# Altium schematic sheet POWER.SchDoc
size A4; SheetNumber: 2; SheetTotal: 3
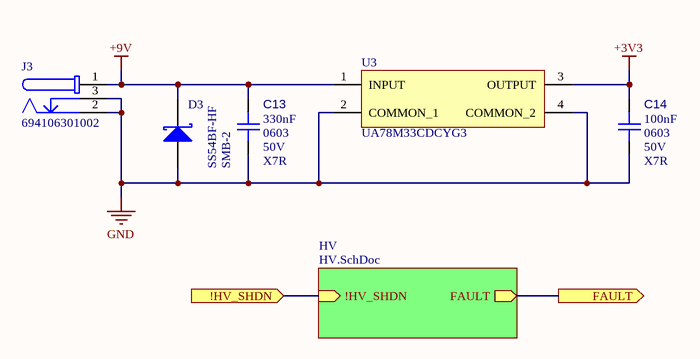
[diagram p0: POWER.SchDoc]

## Parts
?  (no value)
C13  value 330nF  Rated DC Voltage (URdc): 50V  Case/Package: 0603  Dielectric: X7R  [CAPC1608X10N]  (hidden comment: C1608X7R1H334K080AC)
C14  value 100nF  Voltage Rating: 50V  Case/Package: 0603  Dielectric: X7R  [CAPC1608X09N]  (hidden comment: CGA3E2X7R1H104K080AA)
D3  SS54BF-HF  Case/Package: SMB-2  [JCET-SMB-2_N]
J3  694106301002  [694106301002]
U3  UA78M33CDCYG3  [SOT-223-DB3_N]

## Sub-sheets
HV = HV.SchDoc: FAULT (out), !HV_SHDN (in)

## Ports
!HV_SHDN (in), FAULT (out)

## Nets
+3V3: C14.1 U3.3(OUTPUT)
+9V: C13.1 D3.2(K) J3.1 U3.1(INPUT)
GND: C13.2 C14.2 D3.1(A) J3.2 J3.3 U3.2(COMMON_1) U3.4(COMMON_2)
!HV_SHDN: port !HV_SHDN, sheet HV/!HV_SHDN
FAULT: port FAULT, sheet HV/FAULT

## Notes on the sheet
- Project:
- Designer:
- Sheet
- of
- Filename:

## Library data of the parts
? = CMP-00003-4: The KETS Schematic Sheet Title Block
C13 = CMP-001-00114-1: Ceramic Capacitor, Multilayer, Ceramic, 50V, 10% +Tol, 10% -Tol, X7R, 15% TC, 0.33uF, Surface Mount, 0603; Multilayer: Yes; JESD-609 Code: e3; Width: 0.8mm; Voltage Rating: 50V; Tolerance  (fill in as +-): 10%; Packaging: Tape and Reel; Dielectric Material: Ceramic; Capacitor Type: Ceramic; Pins: 2; Package Shape: Rectangular; Reach SVHC Compliant: Yes; Package Style: SMTMeter; Min Operating Temperature: -55°C; Length: 1.6mm; Max Operating Temperature: 125°C; Terminal Finish: Nickel; Tolerance (fill in as +-): 10%; Termination: Wraparound; RoHS Compliant: Yes; Mounting Technology: Surface Mount; Temperature Characteristics Code: X7R; Tolerance: 10%; Height: 0.8mm
C14 = CMP-001-00101-1: Ceramic Capacitor, Multilayer, Ceramic, 50V, 10% +Tol, 10% -Tol, X7R, 15% TC, 0.1uF, Surface Mount, 0603; Reference Standard: AEC-Q200; Multilayer: Yes; Tolerance  (fill in as +-): 10%; Mounting Technology: Surface Mount; Max Operating Temperature: 125°C; Min Operating Temperature: -55°C; Tolerance: 10%; Packaging: Tape and Reel; Length: 1.6mm; Package Style: SMTMeter; Width: 0.8mm; Height: 0.8mm; Pins: 2; Reach SVHC Compliant: Yes; RoHS Compliant: Yes; Package Shape: Rectangular; Tolerance (fill in as +-): 10%; Rated DC Voltage (URdc): 50V; JESD-609 Code: e3; Capacitor Type: Ceramic; Termination: Wraparound; Terminal Finish: Nickel; Dielectric Material: Ceramic; Temperature Characteristics Code: X7R
D3 = CMP-004-00006-3: Rectifier Diode, Schottky, 1 Phase, 1 Element, 5A, 40V V(RRM), Silicon; Manufacturer: JCET; Forward Voltage: 550mV; Peak Reverse Current: 1mA; Max Forward Surge Current (Ifsm): 120A; Number of Elements: 1; Datasheet URL: http://wiki.seeedstudio.com/images/3/3f/0310130P1.pdf; Datasheet Version: May-13; Package Reference: SMB-2; RoHS Compliant: Unknown; Max Operating Temperature: 150°C; Min Operating Temperature: -55°C; Manufacturer URL: http://www.cj-elec.com/; Mounting Technology: SM; Package Description: 2-Pin Surface Mount Device, Body 4.315 x 3.62 mm; Number of Terminals: 2; REACH SVHC: Yes; Lifecycle Status: Production; Reverse Standoff Voltage: 40V; Max Output current: 5A; RoHS: Compliant
J3 = CMP-002-00210-1: DC Power Jack Connector WR-DC, Male, Right Angled, THT, 5 A, 24 V; Max Current Rating: 5A; Shielding: Unshielded; Operating Supply Voltage: 24V; Insulation Resistance: 100MΩ; Number of Contacts: 3; Color: Black; Gender: Male; Mounting Technology: Through Hole; Connector Type: Power; Flammability Rating: UL94 V-0; Housing Material: Polyamide; RoHS Compliant: Yes; Current Rating: 5A; Max Operating Temperature: 85°C; Voltage Rating: 24V; Pins: 3; Min Operating Temperature: -40°C; Contact Plating: Tin; Packaging: Bulk; Contact Gender: Female; REACH SVHC: Unknown; Termination: Through Hole; Height: 11mm; RoHS: Compliant; Contact Material: Gold, Tin
U3 = CMP-00395-1: Standard Regulator Pos 3.3V 0.5A 4-Pin(3+Tab) SOT-223 Tube; Manufacturer Lifecycle Status: ACTIVE; Quiescent Current: 4.5mA; Dropout Voltage: 2V; Power Supply Rejection Ratio (PSRR): 80dB; Polarity: Positive; Number of Outputs: 1; Max Output current: 500mA; Min Input Voltage: 5.3V; Max Supply Voltage: 25V; Output Type: Fixed; Width: 3.5mm; Radiation Hardening: No; Lifecycle Status: Production; Min Operating Temperature: -40°C; Thickness: 1.6mm; Height: 1.8mm; Number of Regulators: 1; Output Current: 500mA; Case/Package: SOT-223; Max Operating Temperature: 125°C; Lead Free: Lead Free; Output Voltage: 3.3V; Length: 6.5mm; Packaging: Rail/Tube; Pins: 4; RoHS: Compliant; Mounting Technology: Surface Mount